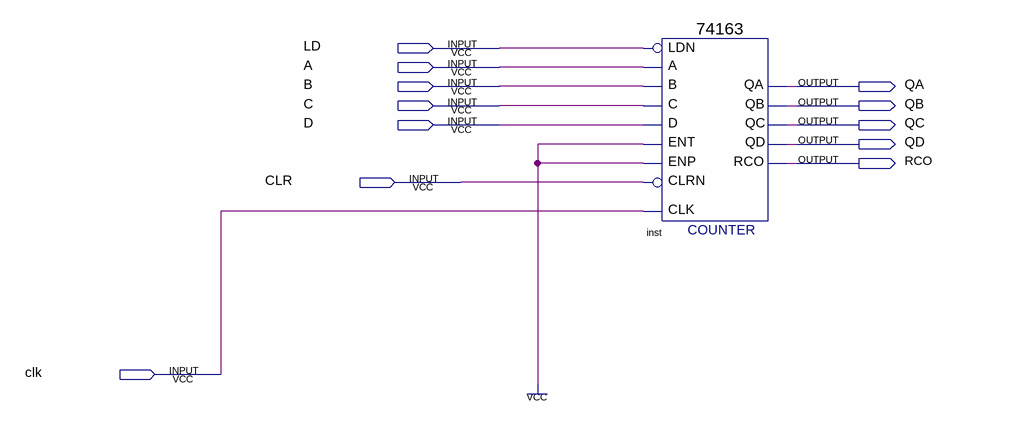
[diagram p0: schematic sheet]
// Quartus schematic Counter4.bdf as structural Verilog: 1 symbols, 12 pins
module Counter4 (
  input  LD,
  input  A,
  input  B,
  input  C,
  input  D,
  input  CLR,
  input  clk,
  output QA,
  output QB,
  output QC,
  output QD,
  output RCO
);

  \74163  inst (
    .C(C), .B(B), .A(A), .ENT(1'b1), .D(D), .CLRN(CLR), .CLK(clk), .ENP(1'b1), .LDN(LD), .QA(QA), .QB(QB),
    .QC(QC), .QD(QD), .RCO(RCO));
endmodule
